# EAGLE design top_PCB_mini (EAGLE 8.1.1)
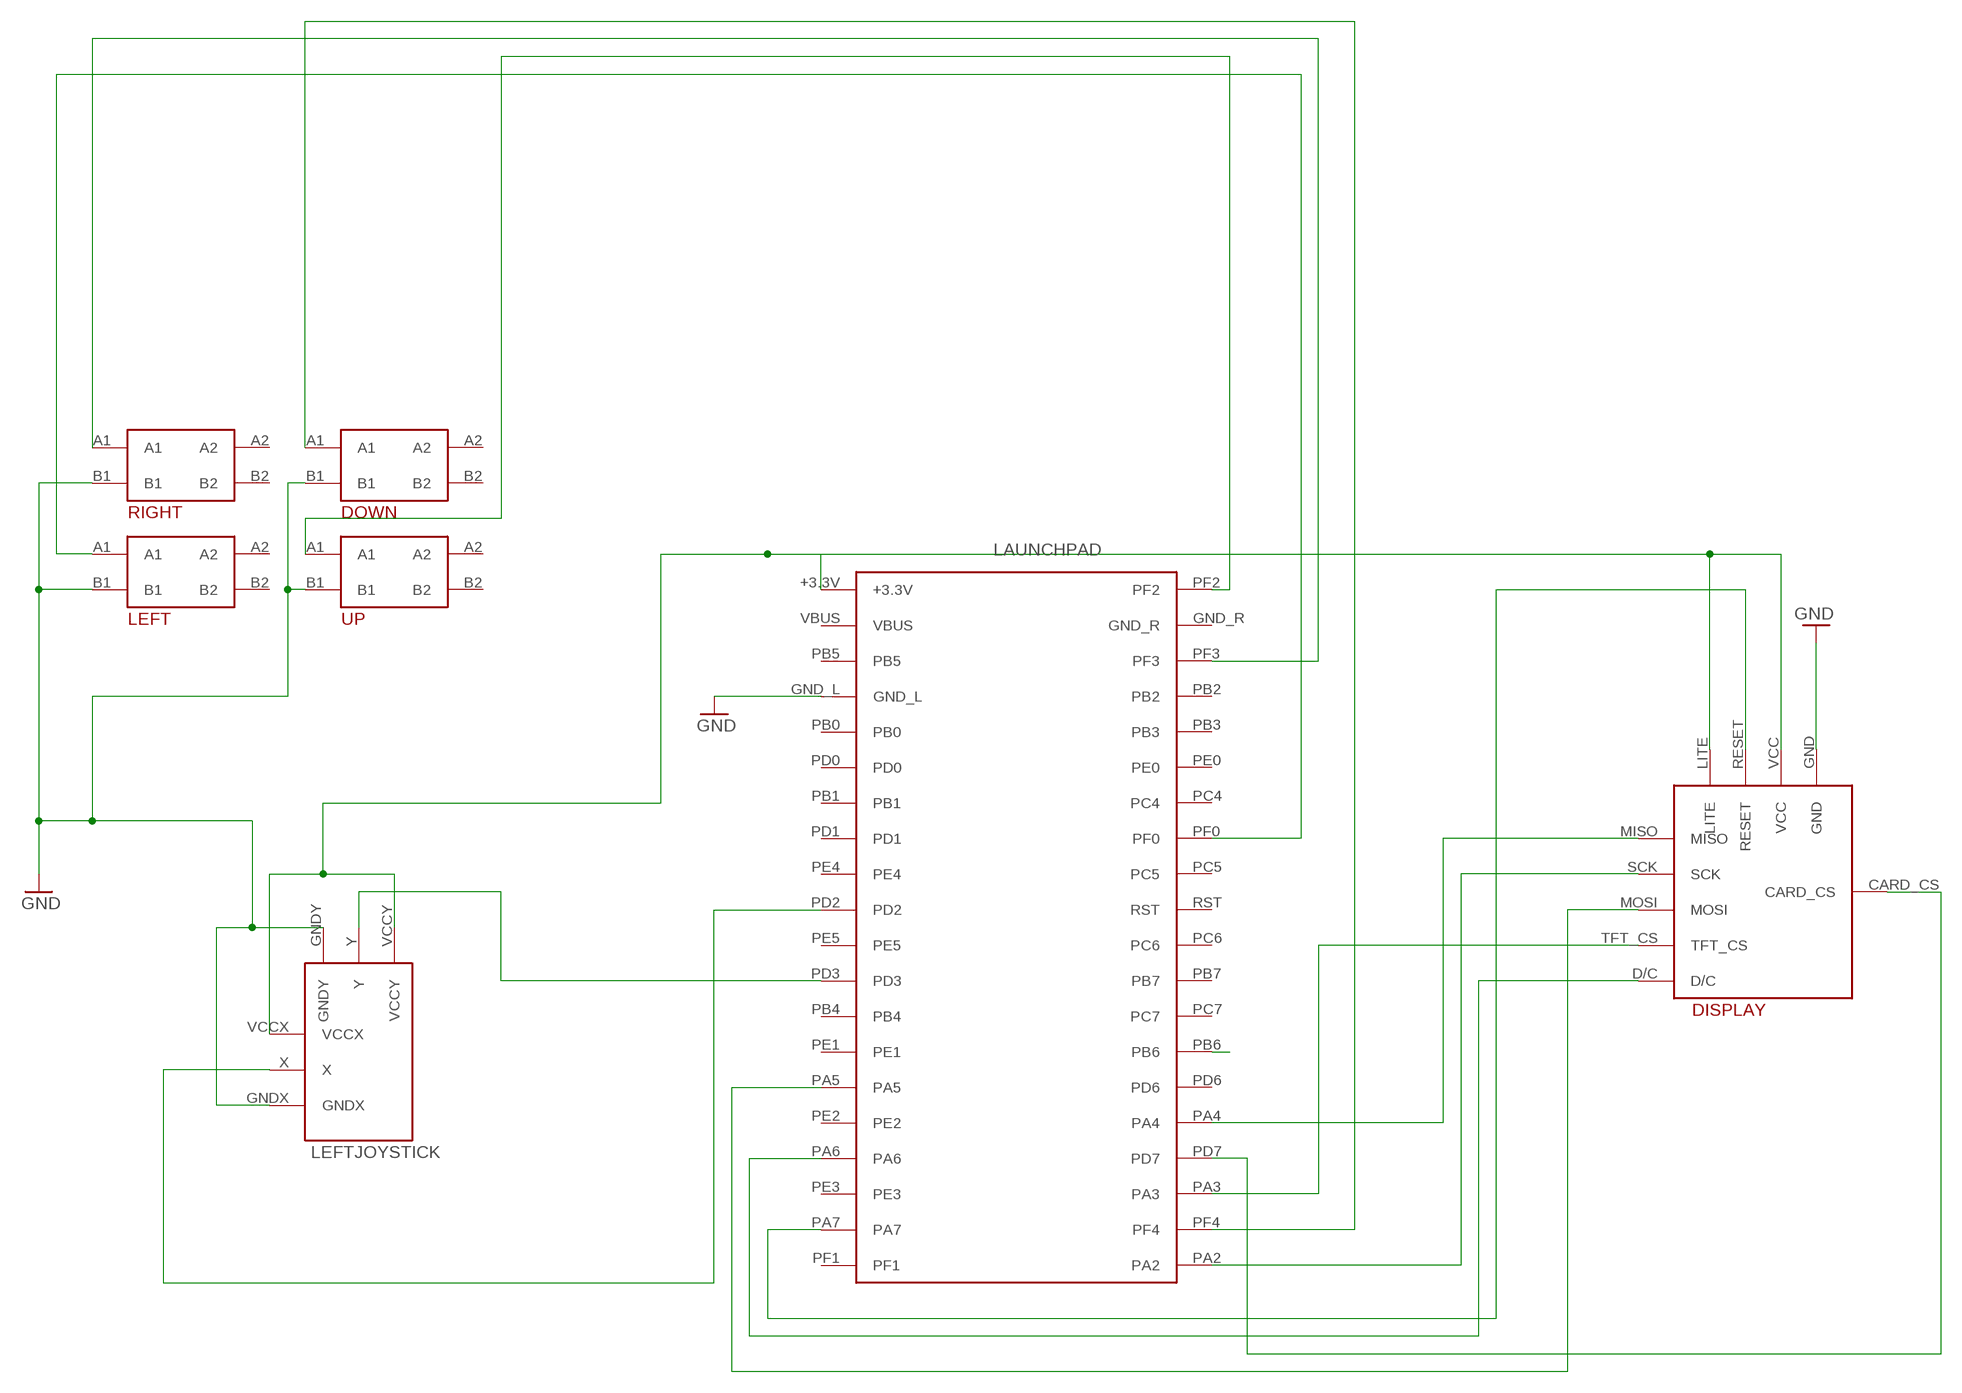
[diagram p0: schematic, sheet 1]

## Parts
DISPLAY  ADAFRUITST7735R_18  [ADAFRUITST7735R_18]
DOWN  TACTILEBUTTONTHROUGHHOLE  [B3F-40XX-MOD]
LAUNCHPAD  TM4CTM4C  [1_05X2MM]
LEFT  TACTILEBUTTONTHROUGHHOLE  [B3F-40XX-MOD]
LEFTJOYSTICK  JOYSTICKADAFRUIT  [JOYSTICK]
RIGHT  TACTILEBUTTONTHROUGHHOLE  [B3F-40XX-MOD]
UP  TACTILEBUTTONTHROUGHHOLE  [B3F-40XX-MOD]

## Nets
GND: DISPLAY.GND DOWN.B1 LAUNCHPAD.GND_L LEFT.B1 LEFTJOYSTICK.GNDX LEFTJOYSTICK.GNDY RIGHT.B1 UP.B1
N$1: DISPLAY.RESET LAUNCHPAD.PA7
N$2: DISPLAY.D/C LAUNCHPAD.PA6
N$3: DISPLAY.CARD_CS LAUNCHPAD.PD7
N$5: DISPLAY.TFT_CS LAUNCHPAD.PA3
N$6: DISPLAY.MOSI LAUNCHPAD.PA5
N$7: DISPLAY.SCK LAUNCHPAD.PA2
N$8: DISPLAY.MISO LAUNCHPAD.PA4
N$9: LAUNCHPAD.PF2 UP.A1
N$10: LAUNCHPAD.PB6
N$11: LAUNCHPAD.PD2 LEFTJOYSTICK.X
N$12: LAUNCHPAD.PD3 LEFTJOYSTICK.Y
N$29: LAUNCHPAD.PF0 LEFT.A1
N$30: LAUNCHPAD.PF3 RIGHT.A1
N$31: DISPLAY.LITE DISPLAY.VCC LAUNCHPAD.+3.3V LEFTJOYSTICK.VCCX LEFTJOYSTICK.VCCY
N$32: DOWN.A1 LAUNCHPAD.PF4
Unconnected: DOWN.A2 DOWN.B2 LAUNCHPAD.PB0 LAUNCHPAD.PB1 LAUNCHPAD.PB2 LAUNCHPAD.PB3 LAUNCHPAD.PB4 LAUNCHPAD.PB5 LAUNCHPAD.PB7 LAUNCHPAD.PC4 LAUNCHPAD.PC5 LAUNCHPAD.PC6 LAUNCHPAD.PC7 LAUNCHPAD.PD0 LAUNCHPAD.PD1 LAUNCHPAD.PD6 LAUNCHPAD.PE0 LAUNCHPAD.PE1 LAUNCHPAD.PE2 LAUNCHPAD.PE3 LAUNCHPAD.PE4 LAUNCHPAD.PE5 LAUNCHPAD.PF1 LAUNCHPAD.RST LEFT.A2 LEFT.B2 RIGHT.A2 RIGHT.B2 UP.A2 UP.B2

## Power pins joined to a net without a drawn wire
GND_R: LAUNCHPAD.GND_R
VBUS: LAUNCHPAD.VBUS

## Library data of the parts
DISPLAY = AdafruitST7735R_18:ADAFRUITST7735R_18: Device for https://www.adafruit.com/product/358
DOWN LEFT RIGHT UP = AdafruitButton:TACTILEBUTTON: Basic library for Adafruit Round Colorful Tactile Button
LAUNCHPAD = TM4C:TM4C: Tiva TM4C Lauchpad. Untested.
LEFTJOYSTICK = AdafruitJoystick:JOYSTICK: Basic version of the Adafruit 2-Axis Analog Thumbstick (PID: 2765). With credits to this (https://github.com/adafruit/Adafruit-Mini-Analog-Thumbstick-Breakout-PCB)

## Board
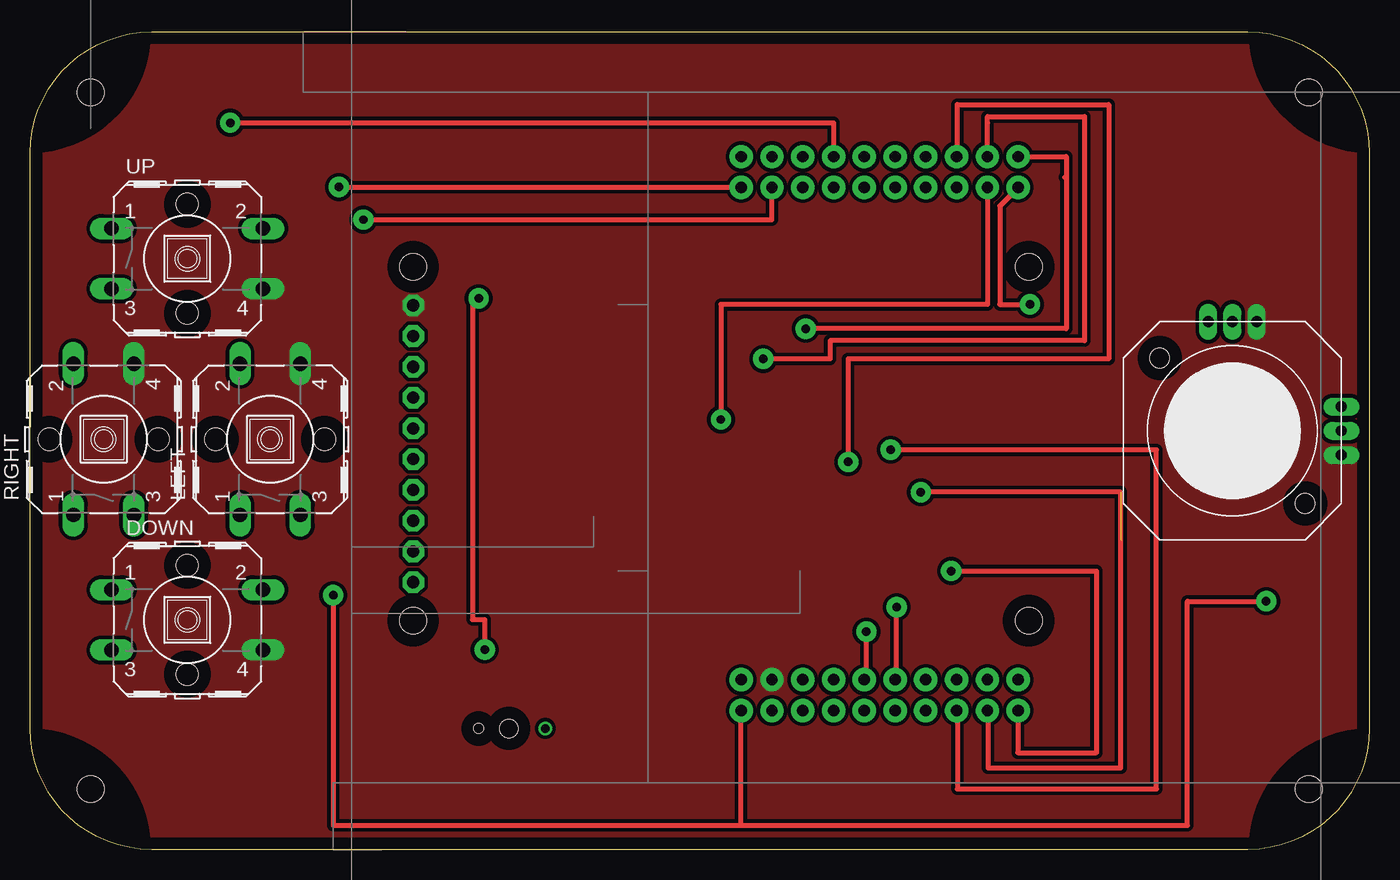
[diagram p1: board, top side]
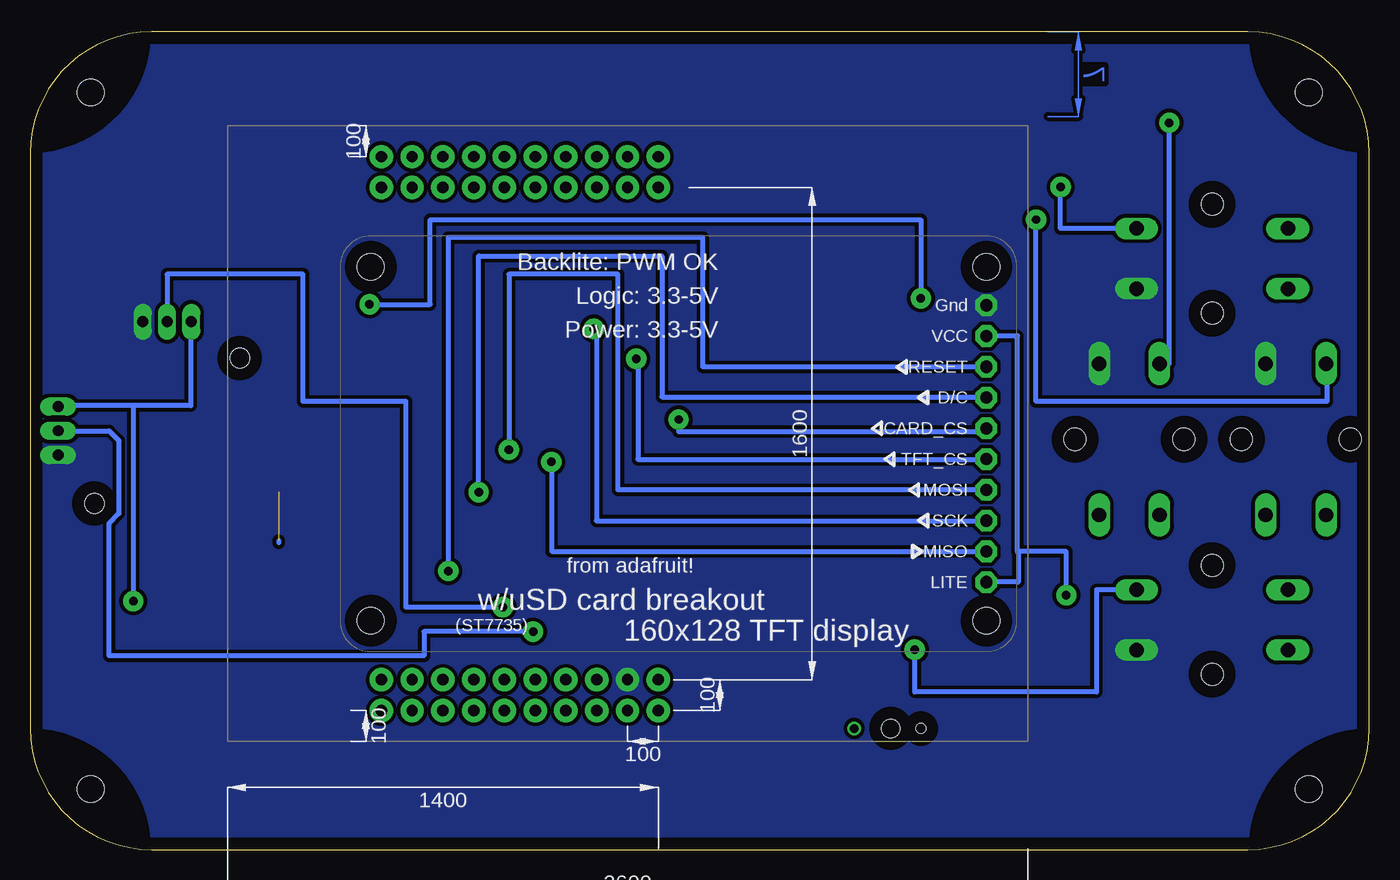
[diagram p2: board, bottom side, seen from below]

Size 110.5 x 67.5 mm. Coordinates in mm from the lower left corner, seen from the top.
Outline: 0,57.5 arc-90 10,67.5 100.5,67.5 arc-90 110.5,57.5 110.5,10 arc-90 100.5,0 10,0 arc-90 0,10 0,57.5
Copper layers (1*16): Top 0.035mm / dielectric 1.5mm / Bottom 0.035mm
Design rules "default": minimum track width 10mil, minimum drill 24mil, track to track 8mil, track to pad 8mil, pad to pad 8mil, via to via 8mil, smd to smd 8mil, copper to edge 40mil, drill to drill 8mil, minimum pad ring 10mil, minimum via ring 8mil, stop-mask expansion 4mil, vias tented up to drill 0mil, thermal gap 10mil
Holes 2.2 mm at 5,5 5,62.5 105.5,62.5 105.5,5
Holes 1.5 mm at 39.5,10
Holes 0.8 mm at 37,10

### Footprints (pad centres in the part's own frame; a part is rotated, then mirrored left to right if it is on the bottom)
ADAFRUITST7735R_18 = drill 1 pad 1.778 octagon: CARD_CS -25.4,-1.27; D/C -25.4,-3.81; GND -25.4,-11.43; LITE -25.4,11.43; MISO -25.4,8.89; MOSI -25.4,3.81; RESET -25.4,-6.35; SCK -25.4,6.35; TFT_CS -25.4,1.27; VCC -25.4,-8.89 | hole 2.2: -25.4,14.605; -25.4,-14.605; 25.4,-14.605; 25.4,14.605
B3F-40XX-MOD = drill 1.194 long: A1 6.218,2.559; A2 -6.278,2.559; B1 6.218,-2.419; B2 -6.278,-2.419 | hole 1.803: -0.03,-4.426; -0.03,4.566
1_05X2MM = drill 0.94 pad 1.93: +3.3V -7.62,8.89; GND_L -10.16,6.35; GND_R -53.34,8.89; PA2 -53.34,-13.97; PA3 -53.34,-11.43; PA4 -53.34,-8.89; PA5 -7.62,-8.89; PA6 -7.62,-11.43; PA7 -7.62,-13.97; PB0 -7.62,3.81; PB1 -7.62,1.27; PB2 -53.34,6.35; PB3 -50.8,3.81; PB4 -7.62,-6.35; PB5 -7.62,6.35; PB6 -53.34,-6.35; PB7 -53.34,-3.81; PC4 -50.8,1.27; PC5 -50.8,-1.27; PC6 -50.8,-3.81; PC7 -50.8,-6.35; PD0 -10.16,3.81; PD1 -10.16,1.27; PD2 -10.16,-1.27; PD3 -10.16,-3.81; PD6 -50.8,-8.89; PD7 -50.8,-11.43; PE0 -53.34,3.81; PE1 -10.16,-6.35; PE2 -10.16,-8.89; PE3 -10.16,-11.43; PE4 -7.62,-1.27; PE5 -7.62,-3.81; PF0 -53.34,1.27; PF1 -10.16,-13.97; PF2 -50.8,8.89; PF3 -50.8,6.35; PF4 -50.8,-13.97; RST -53.34,-1.27; VBUS -10.16,8.89
JOYSTICK = drill 0.9 pad 1.5 long: GNDX 8.62,-2.33; GNDY 1.62,8.67; VCCX 8.62,1.67; VCCY -2.38,8.67; X 8.62,-0.33; Y -0.38,8.67 | hole 1.6: -6.38,5.67; 5.62,-6.33

### Placement (x,y rotation side)
DISPLAY  57,33.5 180 bottom
DOWN  12.99,18.89 0 top
LAUNCHPAD  67.56,3.86 270 bottom
LEFT  19.86,33.9 90 top
LEFTJOYSTICK  99.59,34.9 0 top
RIGHT  6.12,33.9 90 top
UP  12.99,48.71 0 top

### Tracks (layer width: path | path; a pad name or v marks a point on that pad's centre or on a via)
GND
  pour Bottom (isolate 0.305, no thermals): 10,67.5 arc-90 0,57.5 0,10 arc-90 10,0 100.5,0 arc-90 110.5,10 110.5,57.5 arc-90 100.5,67.5
  pour Top (isolate 0.305, no thermals): 10,67.5 arc-90 0,57.5 0,10 arc-90 10,0 100.5,0 arc-90 110.5,10 110.5,57.5 arc-90 100.5,67.5
N$1  (via drill 0.7 pad 1.68)
  Top 0.406: LAUNCHPAD.PA7 81.5,11.48 81.5,8 88,8 88,23 v76,23
  Bottom 0.406: DISPLAY.RESET 55,39.85 55,50.5 76,50.5 v76,23
N$2  (via drill 0.7 pad 1.68)  (1 unrouted)
  Top 0.406: LAUNCHPAD.PA6 79.05,11.48 79.05,6.74 90,6.74 90,29.5 v73.5,29.5
  Bottom 0.406: 90,25.5 90,25.32 | v73.5,29.5 73.5,49 58.37,49 58.37,37.37 31.6,37.37 DISPLAY.D/C
N$3  (via drill 0.7 pad 1.68)
  Top 0.406: LAUNCHPAD.PD7 79,45 57,45 v57,35.5
  Bottom 0.406: v57,35.5 57,34.5 31.6,34.5 DISPLAY.CARD_CS
N$4  (via drill 0.7)
  other vias: 42.5,10
N$5  (via drill 0.7 pad 1.68)
  Top 0.406: LAUNCHPAD.PA3 79,60 79,60.5 87,60.5 87,42 66,42 66,40.5 v60.5,40.5
  Bottom 0.406: v60.5,40.5 60.35,40.5 60.35,32.22 DISPLAY.TFT_CS
N$6  (via drill 0.7 pad 1.68)
  Top 0.406: LAUNCHPAD.PA5 76.5,11.48 76.5,5 92.95,5 92.95,33 v71,33
  Bottom 0.406: DISPLAY.MOSI 62,29.69 62,47.5 71,47.5 v71,33
N$7  (via drill 0.7 pad 1.68)
  Top 0.406: LAUNCHPAD.PA2 85.5,57.2 85.5,55.5 | 85.5,55.5 85.38,55.5 | 85.5,55.5 85.5,43 v64,43
  Bottom 0.406: v64,43 63.77,43 63.77,27.14 DISPLAY.SCK
N$8  (via drill 0.7 pad 1.68)
  Top 0.406: LAUNCHPAD.PA4 76.5,57.2 76.5,61.5 89,61.5 89,40.5 67.5,40.5 v67.5,32
  Bottom 0.406: v67.5,32 67.47,32 67.47,24.62 DISPLAY.MISO
N$9  (via drill 0.7 pad 1.68)
  Top 0.406: v25.47,54.69 58.67,54.69 LAUNCHPAD.PF2
  Bottom 0.406: UP.A1 25.47,51.27 v25.47,54.69
N$11  (via drill 0.7 pad 1.68)
  Top 0.406: LAUNCHPAD.PD2 69,14.02 v69,18
  Bottom 0.406: LEFTJOYSTICK.X 104,34.57 103.19,33.76 103.19,27.73 104,26.92 104,16 78,16 78,18 v69,18
N$12  (via drill 0.7 pad 1.68)
  Top 0.406: LAUNCHPAD.PD3 71.5,14.02 v71.5,20
  Bottom 0.406: v71.5,20 79.5,20 79.5,37 88,37 88,47.5 99.21,47.5 LEFTJOYSTICK.Y
N$29  (via drill 0.7 pad 1.68)
  Top 0.406: v16.5,60 66.29,60 LAUNCHPAD.PF0
  Bottom 0.406: LEFT.A1 16.5,40.12 v16.5,60
N$30  (via drill 0.7 pad 1.68)
  Top 0.406: v27.5,52 61.21,52 LAUNCHPAD.PF3
  Bottom 0.406: RIGHT.A1 3.5,40.12 3.5,37 27.5,37 v27.5,52
N$31  (via drill 0.7 pad 1.68)
  Top 0.406: 58.67,2 95.5,2 95.5,20.5 v102,20.5 | 58.67,2 LAUNCHPAD.+3.3V | v25,21 25,2 58.67,2
  Bottom 0.406: LEFTJOYSTICK.VCCY 97.25,43.57 97.25,36.64 102,36.64 | 102,36.64 108.21,36.64 LEFTJOYSTICK.VCCX | 102,36.64 v102,20.5 | v25,21 25,24.61 29,24.61 | 29,24.61 29,24.5 28.97,24.5 28.97,22.08 DISPLAY.LITE | 29,24.61 29.02,24.61 29.02,42.4 DISPLAY.VCC
N$32  (via drill 0.7 pad 1.68)
  Top 0.406: LAUNCHPAD.PF4 80,53.13 80,45 v82.5,45 | v37,45.5 36.5,45.5 36.5,19 37.5,19 v37.5,16.5
  Bottom 0.406: DOWN.A1 22.5,21.45 22.5,13 37.5,13 v37.5,16.5 | v82.5,45 77.5,45 77.5,52 37,52 v37,45.5
(copper drawn outside any net)
  shapes: Bottom area x1